# EAGLE design pico (EAGLE 9.6.2)
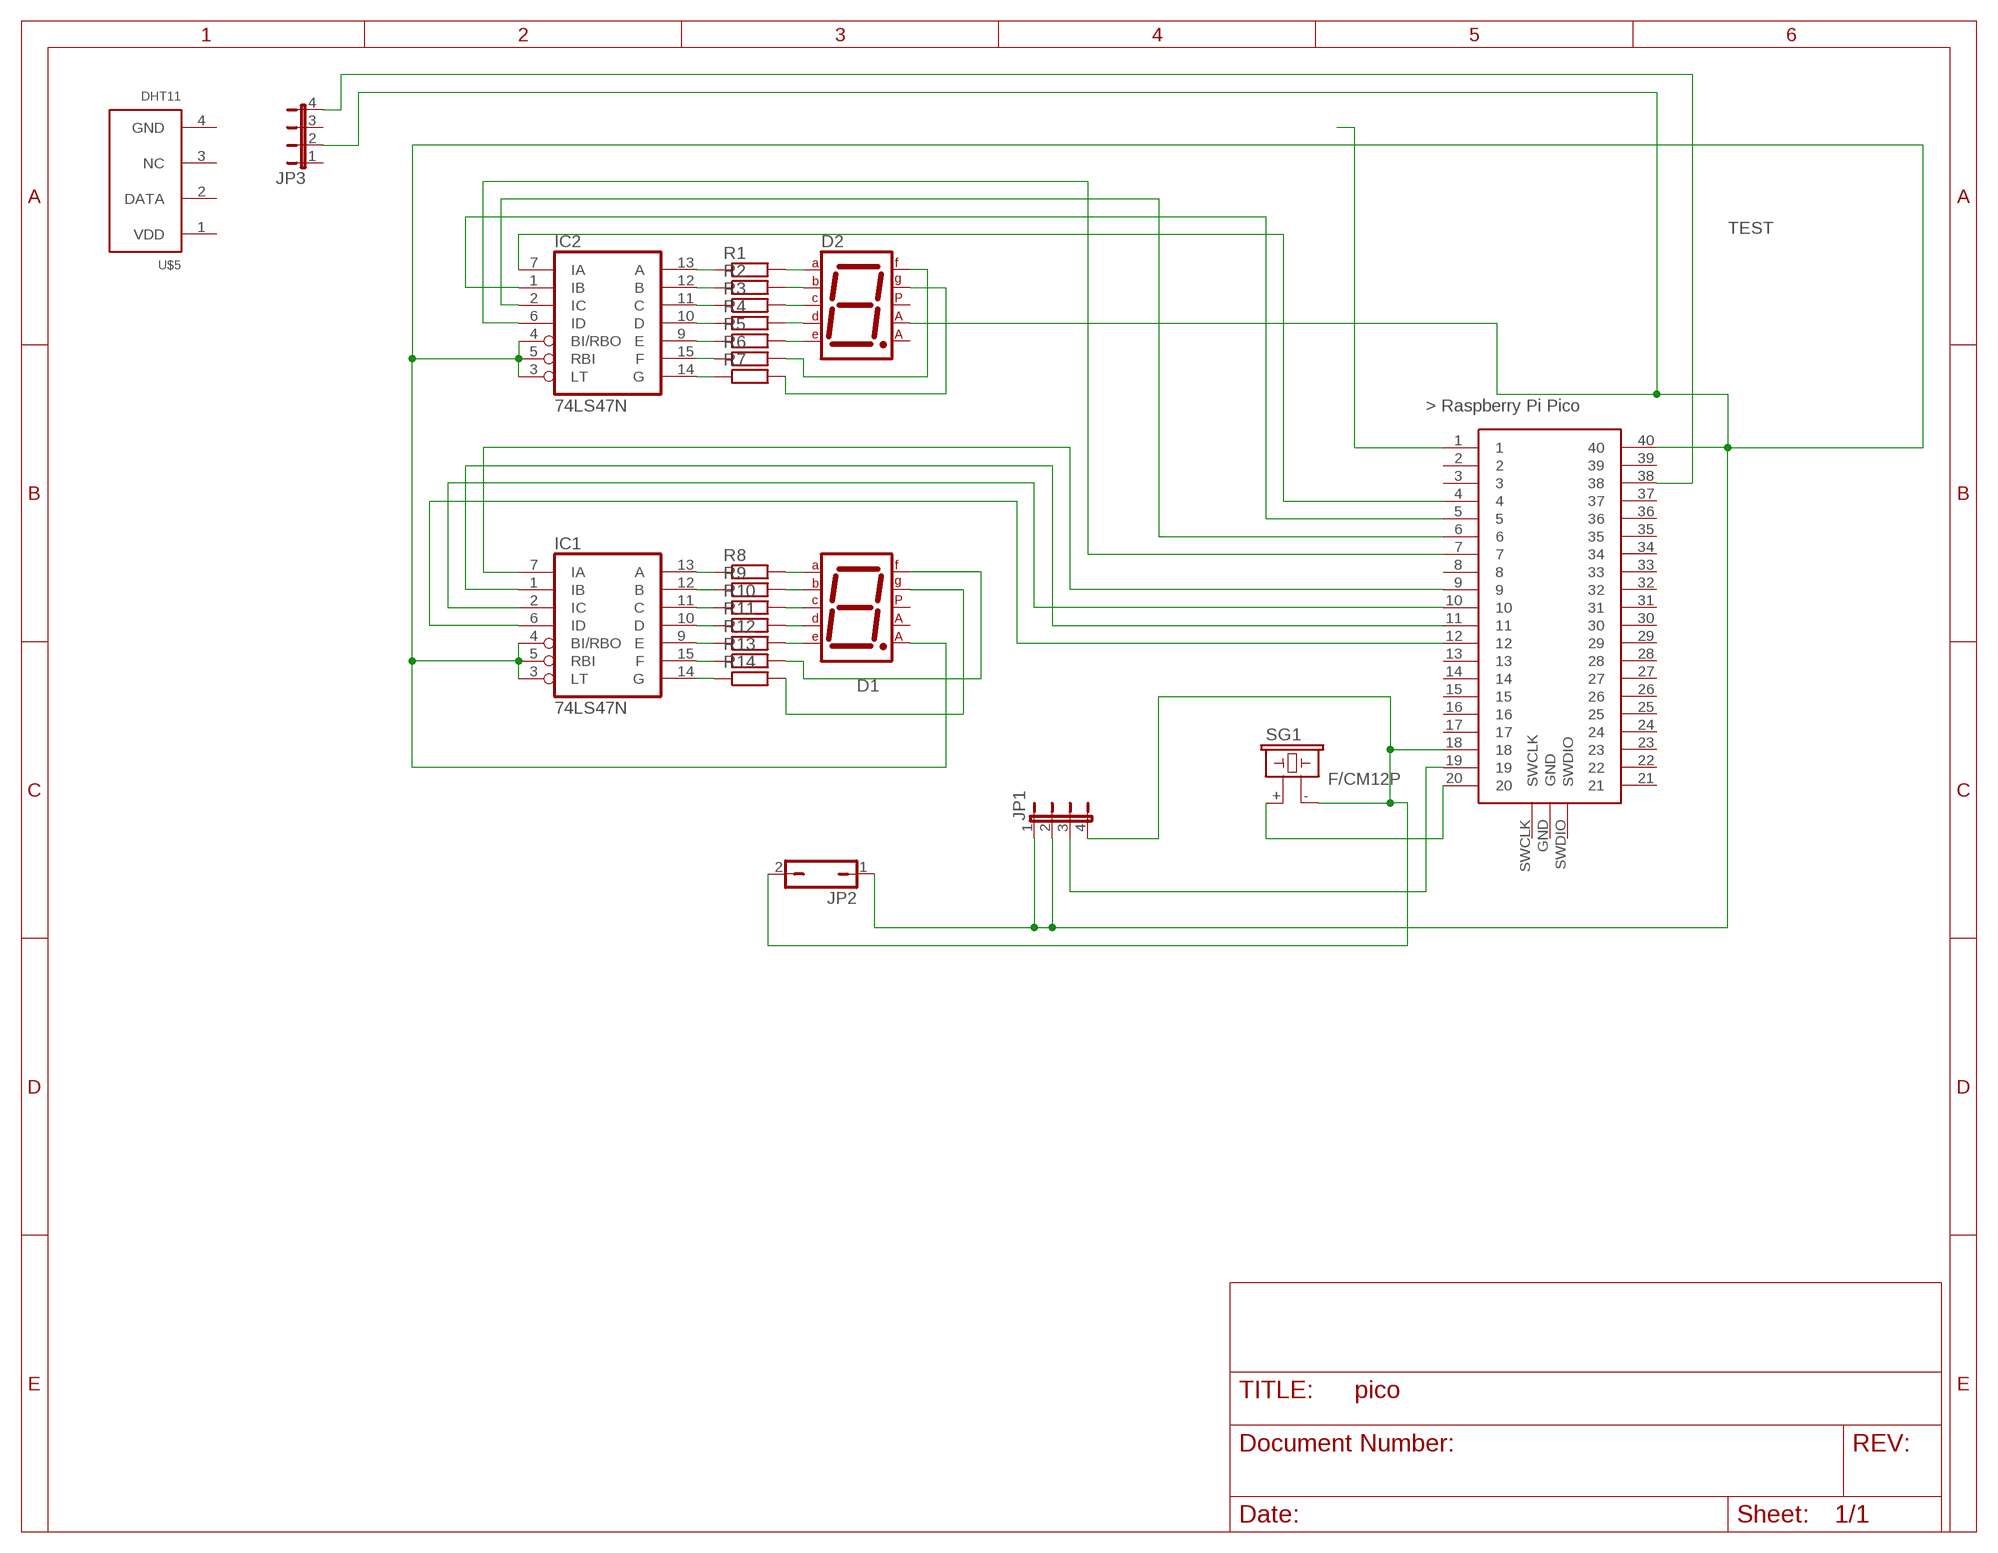
[diagram p0: schematic, sheet 1]

## Parts
D1  7SEG-CA  [7SEG-13]
D2  7SEG-CA  [7SEG-13]
IC1  74LS47N  [DIL16]
IC2  74LS47N  [DIL16]
JP1  JP4E  [JP4]
JP2  JP1Q  [JP1]
JP3  JP4E  [JP4]
R1  R-EU_0207/12  [0207/12]
R2  R-EU_0207/12  [0207/12]
R3  R-EU_0207/12  [0207/12]
R4  R-EU_0207/12  [0207/12]
R5  R-EU_0207/12  [0207/12]
R6  R-EU_0207/12  [0207/12]
R7  R-EU_0207/12  [0207/12]
R8  R-EU_0207/12  [0207/12]
R9  R-EU_0207/12  [0207/12]
R10  R-EU_0207/12  [0207/12]
R11  R-EU_0207/12  [0207/12]
R12  R-EU_0207/12  [0207/12]
R13  R-EU_0207/12  [0207/12]
R14  R-EU_0207/12  [0207/12]
SG1  F/CM12P  [F/CM12P]
U$1  RASPBERRY-PI-PICO_TH  [FT_RASPBERRY-PI-PICO_TH]
U$5  DHT11  [DHT11]

## Nets
N$1: IC1.7(IA) U$1.9
N$2: IC1.14(G) R14.1
N$3: D2.7(A) R1.2
N$4: D2.6(B) R2.2
N$5: IC2.7(IA) U$1.4
N$6: IC2.1(IB) U$1.5
N$7: IC2.2(IC) U$1.6
N$8: IC2.6(ID) U$1.7
N$9: D2.4(C) R3.2
N$10: D2.2(D) R4.2
N$11: D2.1(E) R5.2
N$12: D2.9(F) R6.2
N$13: U$1.1
N$14: JP3.4 U$1.38
N$15: SG1.+ U$1.20
N$16: JP1.4 JP2.2 SG1.- U$1.18
N$17: D2.10(G) R7.2
N$19: JP1.3 U$1.19
N$21: IC1.1(IB) U$1.11
N$22: IC2.13(A) R1.1
N$23: D1.7(A) R8.2
N$24: D1.6(B) R9.2
N$25: D1.4(C) R10.2
N$26: D1.2(D) R11.2
N$27: D1.1(E) R12.2
N$28: D1.9(F) R13.2
N$29: D1.10(G) R14.2
N$31: IC2.12(B) R2.1
N$32: IC2.11(C) R3.1
N$33: IC2.10(D) R4.1
N$34: IC2.9(E) R5.1
N$35: IC2.15(F) R6.1
N$36: IC2.14(G) R7.1
N$37: IC1.13(A) R8.1
N$38: IC1.12(B) R9.1
N$39: IC1.11(C) R10.1
N$40: IC1.10(D) R11.1
N$41: IC1.9(E) R12.1
N$42: IC1.15(F) R13.1
N$43: IC1.2(IC) U$1.10
N$44: IC1.6(ID) U$1.12
TEST: D1.8(CA2) D2.3(CA1) IC1.3(LT) IC1.4(BI/RBO) IC1.5(RBI) IC2.3(LT) IC2.4(BI/RBO) IC2.5(RBI) JP1.1 JP1.2 JP2.1 JP3.2 U$1.40
Unconnected: D1.3(CA1) D1.5(DP) D2.5(DP) D2.8(CA2) JP3.1 JP3.3 U$1.2 U$1.3 U$1.8 U$1.13 U$1.14 U$1.15 U$1.16 U$1.17 U$1.21 U$1.22 U$1.23 U$1.24 U$1.25 U$1.26 U$1.27 U$1.28 U$1.29 U$1.30 U$1.31 U$1.32 U$1.33 U$1.34 U$1.35 U$1.36 U$1.37 U$1.39 U$1.GND U$1.SWCLK U$1.SWDIO U$5.2(DATA) U$5.3(NC)

## Power pins joined to a net without a drawn wire
GND: U$5.4(GND)
TEST: IC1.8(GND) IC2.8(GND)
VCC: IC1.16(VCC) IC2.16(VCC)
VDD: U$5.1(VDD)

## Library data of the parts
D1 D2 = special:7SEG-CA: 7-segment DISPLAY single anode, 13 mm
IC1 IC2 = 74xx-eu:74*47: BCD to seven segment DECODER/DRIVER Source: http://www.ee.washington.edu/stores/DataSheets/74ls/74ls47.pdf
JP1 JP3 = jumper:JP4E: JUMPER
JP2 = jumper:JP1Q: JUMPER
R1-R14 = rcl:R-EU_: RESISTOR, European symbol; SPICEPREFIX: R
SG1 = buzzer:F/CM12P: BUZZER Source: Buerklin; OC_FARNELL: unknown; OC_NEWARK: unknown
U$1 = pipico:RASPBERRY-PI-PICO_TH: Raspberry Pi Pico microcontroller board for through-hole mounting.
U$5 = dht:DHT11

## Board
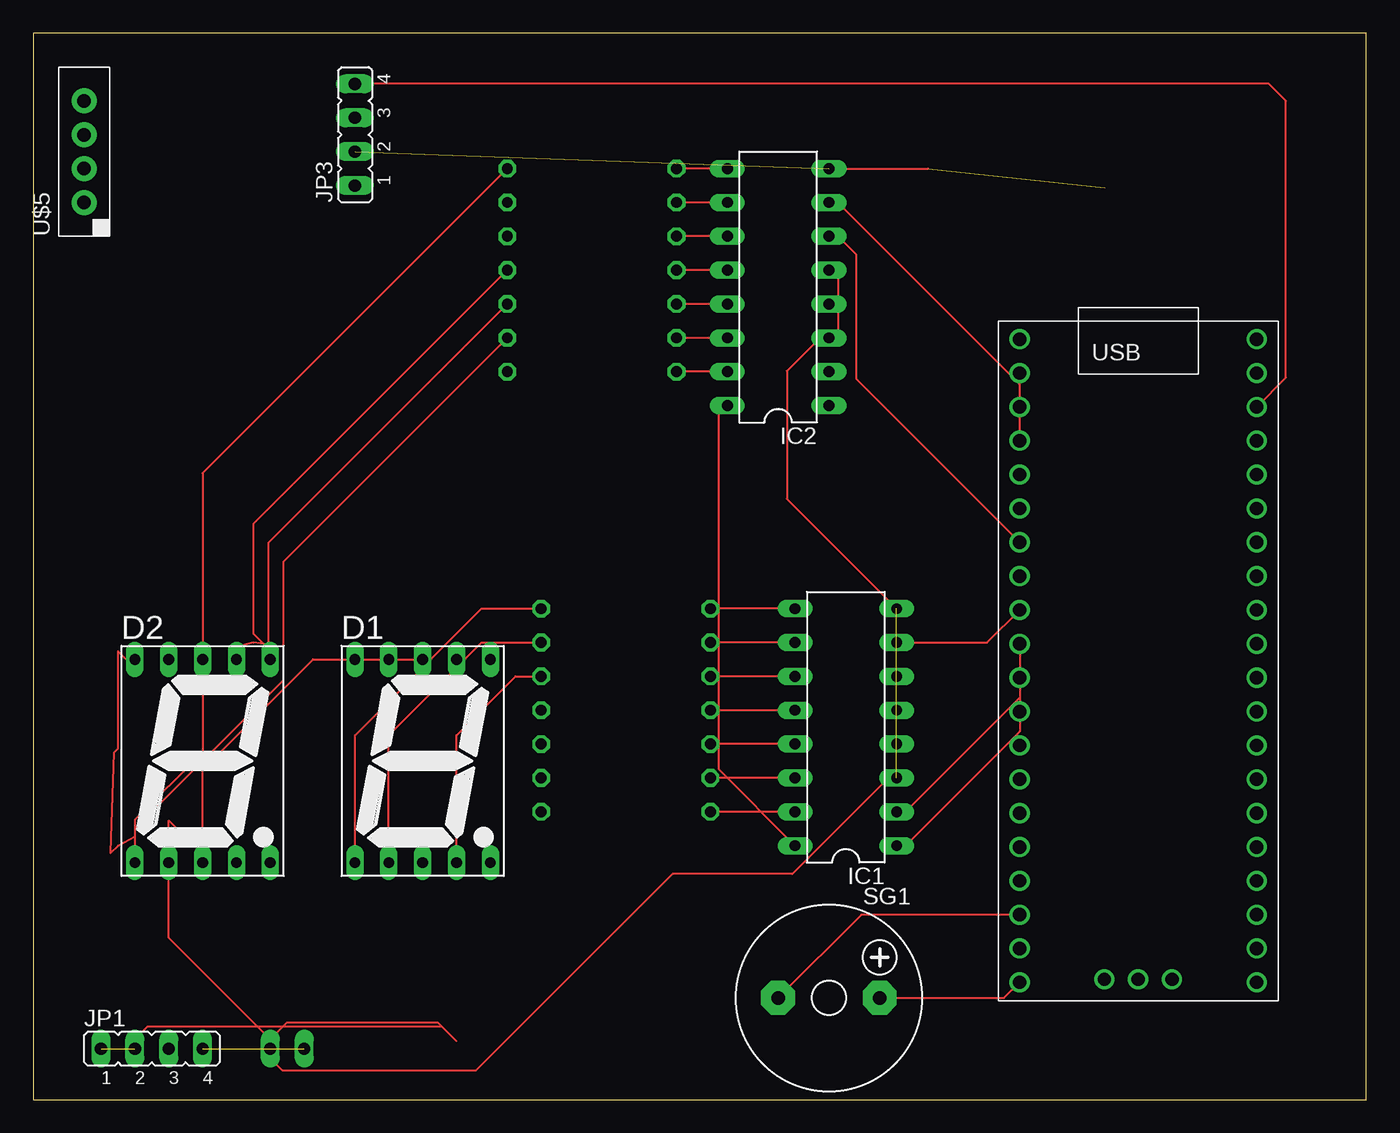
[diagram p1: board, top side]
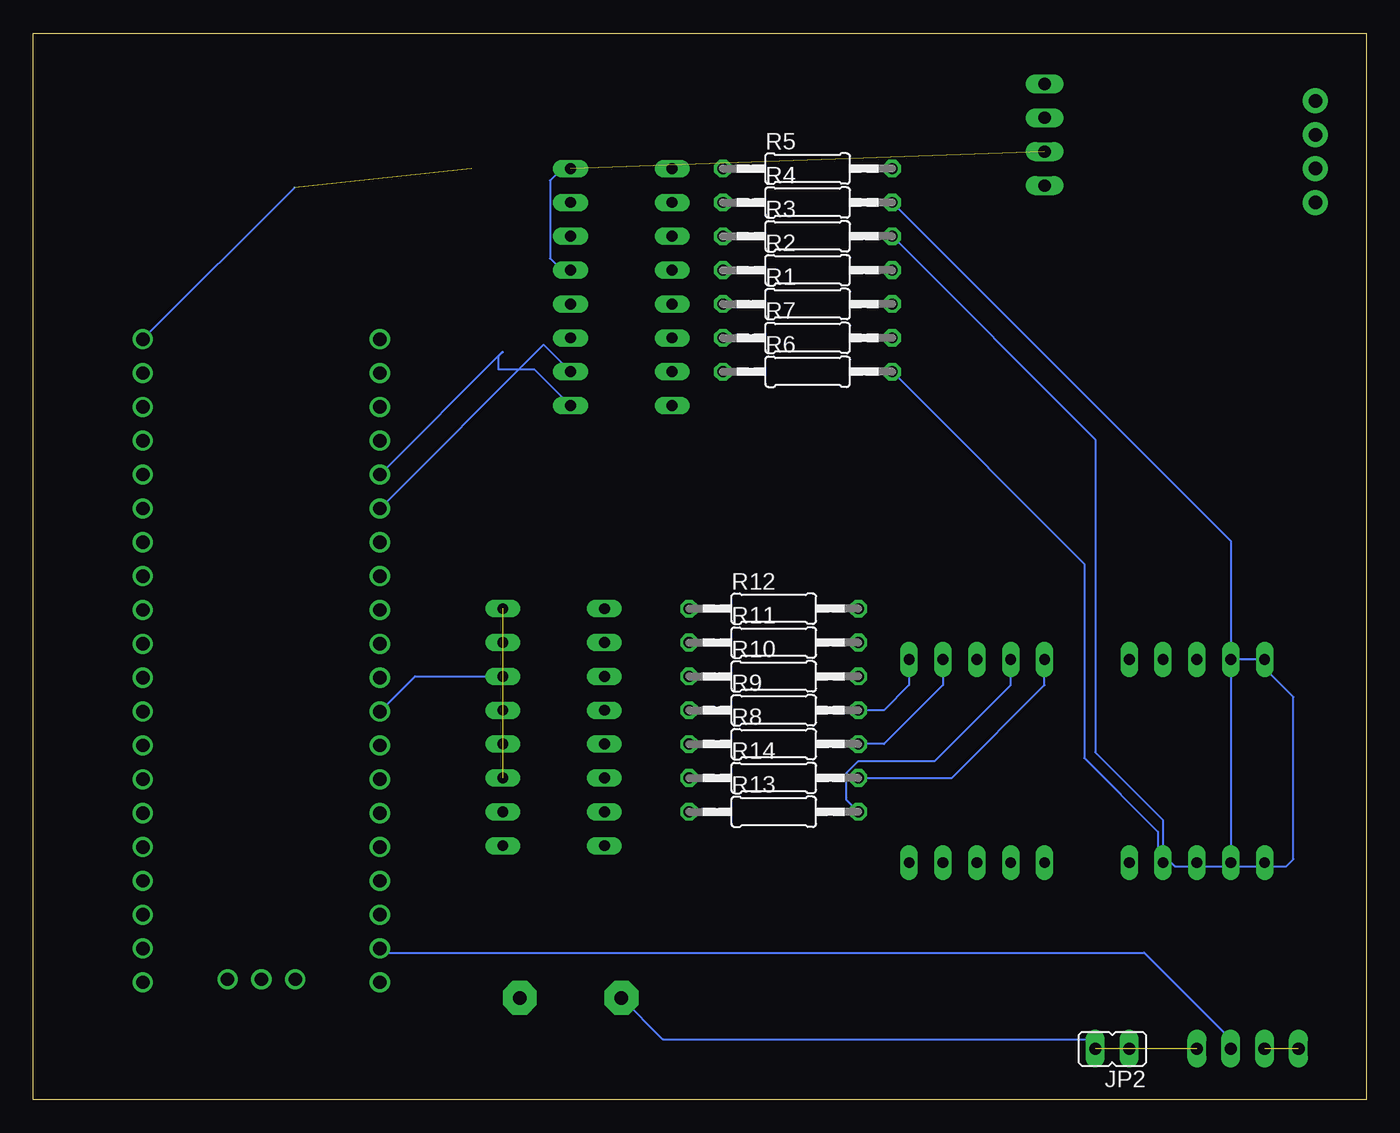
[diagram p2: board, bottom side, seen from below]

Size 100 x 80 mm. Coordinates in mm from the lower left corner, seen from the top.
Outline: 0,0 100,0 100,80 0,80 0,0
Copper layers (1*16): Top 0.035mm / dielectric 1.5mm / Bottom 0.035mm
Design rules "default": minimum track width 6mil, minimum drill 0.35mm, track to track 6mil, track to pad 6mil, pad to pad 6mil, via to via 6mil, smd to smd 6mil, copper to edge 40mil, drill to drill 6mil, minimum pad ring 10mil, minimum via ring 8mil, stop-mask expansion 4mil, vias tented up to drill 0mil, thermal gap 10mil

### Footprints (pad centres in the part's own frame; a part is rotated, then mirrored left to right if it is on the bottom)
7SEG-13 = drill 0.813 long: 1 -5.08,-7.62; 2 -2.54,-7.62; 3 0,-7.62; 4 2.54,-7.62; 5 5.08,-7.62; 6 5.08,7.62; 7 2.54,7.62; 8 0,7.62; 9 -2.54,7.62; 10 -5.08,7.62
DIL16 = drill 0.813 long: 1 -8.89,-3.81; 2 -6.35,-3.81; 3 -3.81,-3.81; 4 -1.27,-3.81; 5 1.27,-3.81; 6 3.81,-3.81; 7 6.35,-3.81; 8 8.89,-3.81; 9 8.89,3.81; 10 6.35,3.81; 11 3.81,3.81; 12 1.27,3.81; 13 -1.27,3.81; 14 -3.81,3.81; 15 -6.35,3.81; 16 -8.89,3.81
JP4 = drill 0.914 long: 1 -3.81,0; 2 -1.27,0; 3 1.27,0; 4 3.81,0
JP1 = drill 0.914 long: 1 0,-1.27; 2 0,1.27
0207/12 = drill 0.813 octagon: 1 -6.35,0; 2 6.35,0
F/CM12P = drill 1.016 pad 2.54 octagon: + 3.81,0; - -3.81,0
FT_RASPBERRY-PI-PICO_TH = drill 1: 1 -8.55,24.03; 2 -8.55,21.49; 3 -8.55,18.95; 4 -8.55,16.41; 5 -8.55,13.87; 6 -8.55,11.33; 7 -8.55,8.79; 8 -8.55,6.25; 9 -8.55,3.71; 10 -8.55,1.17; 11 -8.55,-1.37; 12 -8.55,-3.91; 13 -8.55,-6.45; 14 -8.55,-8.99; 15 -8.55,-11.53; 16 -8.55,-14.07; 17 -8.55,-16.61; 18 -8.55,-19.15; 19 -8.55,-21.69; 20 -8.55,-24.23; 21 9.23,-24.23; 22 9.23,-21.69; 23 9.23,-19.15; 24 9.23,-16.61; 25 9.23,-14.07; 26 9.23,-11.53; 27 9.23,-8.99; 28 9.23,-6.45; 29 9.23,-3.91; 30 9.23,-1.37; 31 9.23,1.17; 32 9.23,3.71; 33 9.23,6.25; 34 9.23,8.79; 35 9.23,11.33; 36 9.23,13.87; 37 9.23,16.41; 38 9.23,18.95; 39 9.23,21.49; 40 9.23,24.03; GND 0.34,-24; SWCLK -2.2,-24; SWDIO 2.88,-24
DHT11 = drill 1.016 pad 1.88: 1 -3.81,0; 2 -1.27,0; 3 1.27,0; 4 3.81,0

### Placement (x,y rotation side)
D1  29.21,25.4 0 top
D2  12.7,25.4 0 top
IC1  60.96,27.94 90 top
IC2  55.88,60.96 90 top
JP1  8.89,3.81 0 top
JP2  19.05,3.81 90 bottom
JP3  24.13,72.39 90 top
R1  41.91,59.69 0 bottom
R2  41.91,62.23 0 bottom
R3  41.91,64.77 0 bottom
R4  41.91,67.31 0 bottom
R5  41.91,69.85 0 bottom
R6  41.91,54.61 0 bottom
R7  41.91,57.15 0 bottom
R8  44.45,26.67 0 bottom
R9  44.45,29.21 0 bottom
R10  44.45,31.75 0 bottom
R11  44.45,34.29 0 bottom
R12  44.45,36.83 0 bottom
R13  44.45,21.59 0 bottom
R14  44.45,24.13 0 bottom
SG1  59.69,7.62 0 top
U$1  82.55,33.02 0 top
U$5  3.81,71.12 90 top

### Tracks (layer width: path | path; a pad name or v marks a point on that pad's centre or on a via)
N$1
  Top 0.152: U$1.9 71.56,34.29 IC1.7
N$2
  Top 0.152: IC1.14 56.49,24.13 R14.1
N$3
  Top 0.152: R1.2 17.63,41.76 17.63,34.14 16.51,34.29 15.24,33.96 D2.7
N$4
  Top 0.152: R2.2 16.51,43.18 16.51,34.95 17.78,33.68 D2.6
N$5
  Top 0.152: U$1.4 74,53.66 60.35,67.31 IC2.7
N$6
  Bottom 0.152: U$1.5 64.78,56.11 64.79,56.07 65.12,55.74 65.12,54.8 62.42,54.8 IC2.1
N$7
  Bottom 0.152: U$1.6 61.72,56.63 IC2.2
N$8
  Top 0.152: U$1.7 61.74,54.07 61.74,63.38 60.35,64.77 IC2.6
N$9
  Bottom 0.152: R3.2 20.32,49.53 20.32,26.06 15.24,20.98 D2.4
N$10
  Bottom 0.152: R4.2 10.16,41.91 D2.2
N$11
  Top 0.152: R5.2 12.7,46.99 12.7,26.06 7.62,20.98 D2.1
N$12
  Bottom 0.152: R6.2 21.15,40.2 21.15,25.62 15.62,20.09 15.62,18.78 14.34,17.5 5.98,17.5 5.46,18.02 5.46,30.2 8.28,33.02 D2.9
N$14
  Top 0.152: U$1.38 93.98,54.17 93.98,74.93 92.71,76.2 JP3.4
N$15
  Top 0.152: U$1.20 72.83,7.62 SG1.+
N$16  (1 unrouted)
  Top 0.152: U$1.18 62.13,13.87 SG1.-
  Bottom 0.152: SG1.- 52.78,4.52 20.32,4.52 JP2.2
N$17
  Top 0.152: R7.2 18.75,40.34 18.75,31.45 7.62,20.32 7.62,19.71 6.35,19.05 5.79,18.49 6.07,26.06 6.35,26.34 6.35,33.63 6.96,33.02 D2.10
N$19
  Bottom 0.152: U$1.19 73.68,11.01 16.65,11.01 10.16,4.52 JP1.3
N$21
  Top 0.152: U$1.11 74,27.62 65.43,19.05 IC1.1
N$22
  Top 0.152: IC2.13 R1.1
N$23
  Bottom 0.152: D1.7 31.75,31.09 36.17,26.67 R8.2
N$24
  Bottom 0.152: D1.6 34.29,31.09 36.17,29.21 R9.2
N$25
  Top 0.152: D1.4 31.75,27.33 36.17,31.75 R10.2
N$26
  Top 0.152: D1.2 26.67,27.33 33.63,34.29 R11.2
N$27
  Top 0.152: D1.1 24.13,27.33 33.63,36.83 R12.2
N$28
  Bottom 0.152: R13.2 38.99,22.48 38.99,24.5 38.09,25.4 32.36,25.4 26.67,31.09 D1.9
N$29
  Bottom 0.152: R14.2 31.09,24.13 24.13,31.09 D1.10
N$31
  Top 0.152: IC2.12 R2.1
N$32
  Top 0.152: IC2.11 R3.1
N$33
  Top 0.152: IC2.10 R4.1
N$34
  Top 0.152: IC2.9 R5.1
N$35
  Top 0.152: IC2.15 R6.1
N$36
  Top 0.152: IC2.14 R7.1
N$37
  Top 0.152: IC1.13 56.49,26.67 R8.1
N$38
  Top 0.152: IC1.12 56.49,29.21 R9.1
N$39
  Top 0.152: IC1.11 56.49,31.75 R10.1
N$40
  Top 0.152: IC1.10 56.49,34.29 R11.1
N$41
  Top 0.152: IC1.9 56.49,36.83 R12.1
N$42
  Top 0.152: IC1.15 56.49,21.59 R13.1
N$43
  Top 0.152: U$1.10 74,30.16 65.43,21.59 IC1.2
N$44
  Bottom 0.152: U$1.12 71.36,31.75 IC1.6
TEST  (6 unrouted)
  Top 0.152: 17.78,4.52 10.16,12.14 10.16,20.93 11.05,20.04 12.7,20.04 D2.3 12.7,24.74 20.98,33.02 D1.8 | 30.66,5.46 30.38,5.74 19,5.74 17.78,4.52 | 17.78,4.52 JP2.1 17.78,3.1 18.72,2.16 33.2,2.16 47.97,16.93 56.95,16.93 64.11,24.09 64.11,24.13 IC1.3 | IC2.8 67.13,69.85 | IC1.8 56.54,45.06 56.54,54.66 59.03,57.15 IC2.3 60.35,57.15 60.35,59.69 | IC2.5 60.35,62.23 60.35,59.69 | IC2.4 60.35,59.69 | 31.75,4.37 30.66,5.46 | 30.66,5.46 8.56,5.46 7.62,4.52 JP1.2
  Bottom 0.152: 80.4,68.43 U$1.40 | IC2.8 60.35,69.85 61.24,68.96 61.24,63.12 60.35,62.23 IC2.5
VCC
  Top 0.152: IC1.16 51.41,24.79 51.41,52.07 IC2.16
  Bottom 0.152: IC2.16 52.73,52.07